# Altium schematic sheet fantom_power.SchDoc
size A4
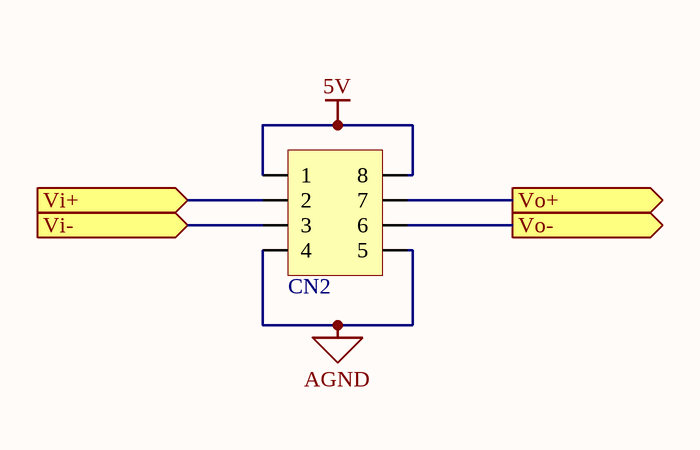
[diagram p0: fantom_power.SchDoc]

## Parts
CN2  Header 4X2  [Header 4x2]  (value not drawn)

## Ports
Vi+ (in), Vi- (in), Vo+ (out), Vo- (out)

## Nets
5V: CN2.1 CN2.8
AGND: CN2.4 CN2.5
Vi+: CN2.2 ; port Vi+
Vi-: CN2.3 ; port Vi-
Vo+: CN2.7 ; port Vo+
Vo-: CN2.6 ; port Vo-